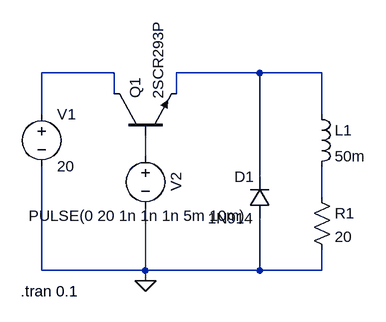
[diagram p0: schematic StepDown_Chopper_R.asc]
StepDown_Chopper_R.asc, the LTspice schematic file:
Version 4
SHEET 1 880 680
WIRE 176 64 64 64
WIRE 400 64 272 64
WIRE 496 64 400 64
WIRE 176 96 176 64
WIRE 272 96 272 64
WIRE 64 128 64 64
WIRE 496 128 496 64
WIRE 224 192 224 160
WIRE 400 224 400 64
WIRE 496 256 496 208
WIRE 64 368 64 208
WIRE 224 368 224 272
WIRE 224 368 64 368
WIRE 400 368 400 288
WIRE 400 368 224 368
WIRE 496 368 496 336
WIRE 496 368 400 368
WIRE 224 384 224 368
FLAG 224 384 0
SYMBOL voltage 64 112 R0
WINDOW 123 0 0 Left 0
WINDOW 39 0 0 Left 0
SYMATTR InstName V1
SYMATTR Value 20
SYMBOL res 480 240 R0
SYMATTR InstName R1
SYMATTR Value 20
SYMBOL npn 176 160 R270
SYMATTR InstName Q1
SYMATTR Value 2SCR293P
SYMBOL voltage 224 176 R0
WINDOW 0 32 56 VTop 2
WINDOW 3 -11 92 Top 2
WINDOW 123 0 0 Left 0
WINDOW 39 0 0 Left 0
SYMATTR InstName V2
SYMATTR Value PULSE(0 20 1n 1n 1n 5m 10m)
SYMBOL diode 416 288 R180
WINDOW 0 24 64 Left 2
WINDOW 3 24 0 Left 2
SYMATTR InstName D1
SYMATTR Value 1N914
SYMBOL ind 480 112 R0
SYMATTR InstName L1
SYMATTR Value 50m
TEXT 32 400 Left 2 !.tran 0.1

The netlist it stands for:
* StepDown_Chopper_R.asc
V1 N001 0 20
R1 N004 0 20
Q1 N001 N003 N002 0 2SCR293P
V2 N003 0 PULSE(0 20 1n 1n 1n 5m 10m)
D1 0 N002 1N914
L1 N002 N004 50m
.model D D
.lib standard.dio
.model NPN NPN
.model PNP PNP
.lib standard.bjt
.tran 0.1
.backanno
.end